# Altium schematic sheet SubSchHVCotrol.SchDoc: High Voltage handling and monitoring
size A3; DocumentNumber: 6; SheetNumber: 6; SheetTotal: 7
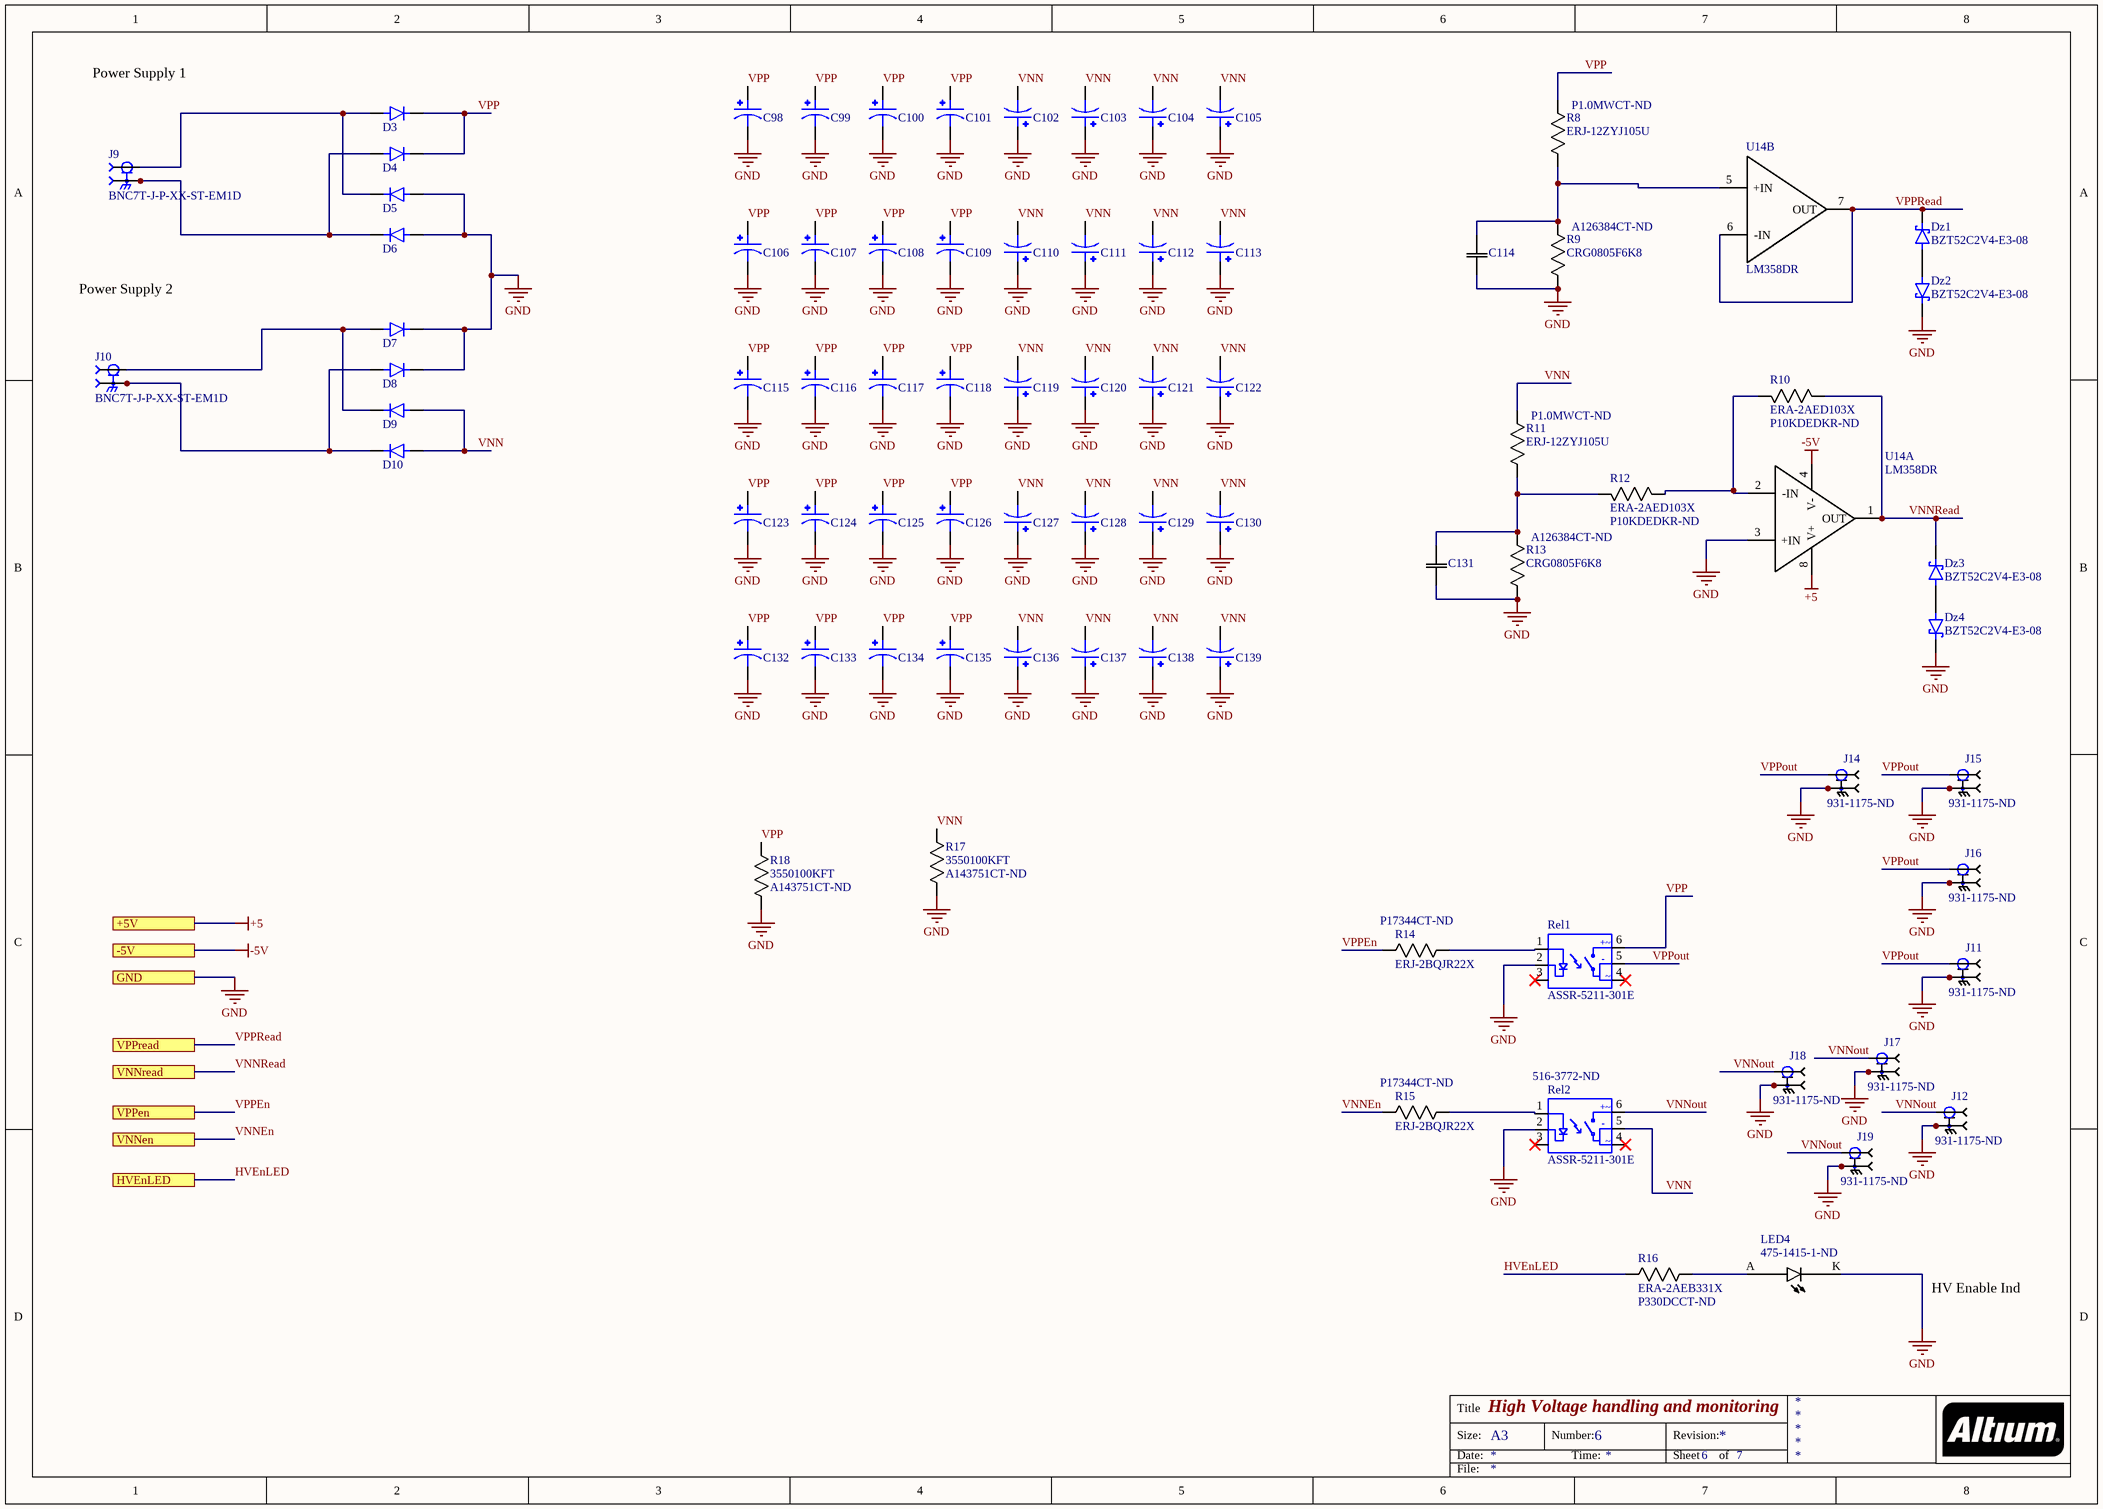
[diagram p0: SubSchHVCotrol.SchDoc]

## Parts
C98  EDH336M400A9TAA  [CAPAE1700X1700N]  (value not drawn)
C99  EDH336M400A9TAA  [CAPAE1700X1700N]  (value not drawn)
C100  EDH336M400A9TAA  [CAPAE1700X1700N]  (value not drawn)
C101  EDH336M400A9TAA  [CAPAE1700X1700N]  (value not drawn)
C102  EDH336M400A9TAA  [CAPAE1700X1700N]  (value not drawn)
C103  EDH336M400A9TAA  [CAPAE1700X1700N]  (value not drawn)
C104  EDH336M400A9TAA  [CAPAE1700X1700N]  (value not drawn)
C105  EDH336M400A9TAA  [CAPAE1700X1700N]  (value not drawn)
C106  EDH336M400A9TAA  [CAPAE1700X1700N]  (value not drawn)
C107  EDH336M400A9TAA  [CAPAE1700X1700N]  (value not drawn)
C108  EDH336M400A9TAA  [CAPAE1700X1700N]  (value not drawn)
C109  EDH336M400A9TAA  [CAPAE1700X1700N]  (value not drawn)
C110  EDH336M400A9TAA  [CAPAE1700X1700N]  (value not drawn)
C111  EDH336M400A9TAA  [CAPAE1700X1700N]  (value not drawn)
C112  EDH336M400A9TAA  [CAPAE1700X1700N]  (value not drawn)
C113  EDH336M400A9TAA  [CAPAE1700X1700N]  (value not drawn)
C114  C0805C104Z5VACTU  [C0805]  (value not drawn)
C115  EDH336M400A9TAA  [CAPAE1700X1700N]  (value not drawn)
C116  EDH336M400A9TAA  [CAPAE1700X1700N]  (value not drawn)
C117  EDH336M400A9TAA  [CAPAE1700X1700N]  (value not drawn)
C118  EDH336M400A9TAA  [CAPAE1700X1700N]  (value not drawn)
C119  EDH336M400A9TAA  [CAPAE1700X1700N]  (value not drawn)
C120  EDH336M400A9TAA  [CAPAE1700X1700N]  (value not drawn)
C121  EDH336M400A9TAA  [CAPAE1700X1700N]  (value not drawn)
C122  EDH336M400A9TAA  [CAPAE1700X1700N]  (value not drawn)
C123  EDH336M400A9TAA  [CAPAE1700X1700N]  (value not drawn)
C124  EDH336M400A9TAA  [CAPAE1700X1700N]  (value not drawn)
C125  EDH336M400A9TAA  [CAPAE1700X1700N]  (value not drawn)
C126  EDH336M400A9TAA  [CAPAE1700X1700N]  (value not drawn)
C127  EDH336M400A9TAA  [CAPAE1700X1700N]  (value not drawn)
C128  EDH336M400A9TAA  [CAPAE1700X1700N]  (value not drawn)
C129  EDH336M400A9TAA  [CAPAE1700X1700N]  (value not drawn)
C130  EDH336M400A9TAA  [CAPAE1700X1700N]  (value not drawn)
C131  C0805C104Z5VACTU  [C0805]  (value not drawn)
C132  EDH336M400A9TAA  [CAPAE1700X1700N]  (value not drawn)
C133  EDH336M400A9TAA  [CAPAE1700X1700N]  (value not drawn)
C134  EDH336M400A9TAA  [CAPAE1700X1700N]  (value not drawn)
C135  EDH336M400A9TAA  [CAPAE1700X1700N]  (value not drawn)
C136  EDH336M400A9TAA  [CAPAE1700X1700N]  (value not drawn)
C137  EDH336M400A9TAA  [CAPAE1700X1700N]  (value not drawn)
C138  EDH336M400A9TAA  [CAPAE1700X1700N]  (value not drawn)
C139  EDH336M400A9TAA  [CAPAE1700X1700N]  (value not drawn)
D3  CD1408-R11000  [CD1408]  (value not drawn)
D4  CD1408-R11000  [CD1408]  (value not drawn)
D5  CD1408-R11000  [CD1408]  (value not drawn)
D6  CD1408-R11000  [CD1408]  (value not drawn)
D7  CD1408-R11000  [CD1408]  (value not drawn)
D8  CD1408-R11000  [CD1408]  (value not drawn)
D9  CD1408-R11000  [CD1408]  (value not drawn)
D10  CD1408-R11000  [CD1408]  (value not drawn)
Dz1  BZT52C2V4-E3-08  [SOD-123]
Dz2  BZT52C2V4-E3-08  [SOD-123]
Dz3  BZT52C2V4-E3-08  [SOD-123]
Dz4  BZT52C2V4-E3-08  [SOD-123]
J9  BNC7T-J-P-XX-ST-EM1D  [SAMTEC_BNC7T-J-P-XX-ST-EM1D]
J10  BNC7T-J-P-XX-ST-EM1D  [SAMTEC_BNC7T-J-P-XX-ST-EM1D]
J11  Supplier Part Number 1: 931-1175-ND  [*TAOGLAS_EMPCB.SMAFSTJ.B.HT_EMPCB.SMAFSTJ.B.HT(Primary)]  (hidden comment: EMPCB.SMAFSTJ.B.HT)
J12  Supplier Part Number 1: 931-1175-ND  [*TAOGLAS_EMPCB.SMAFSTJ.B.HT_EMPCB.SMAFSTJ.B.HT(Primary)]  (hidden comment: EMPCB.SMAFSTJ.B.HT)
J14  Supplier Part Number 1: 931-1175-ND  [*TAOGLAS_EMPCB.SMAFSTJ.B.HT_EMPCB.SMAFSTJ.B.HT(Primary)]  (hidden comment: EMPCB.SMAFSTJ.B.HT)
J15  Supplier Part Number 1: 931-1175-ND  [*TAOGLAS_EMPCB.SMAFSTJ.B.HT_EMPCB.SMAFSTJ.B.HT(Primary)]  (hidden comment: EMPCB.SMAFSTJ.B.HT)
J16  Supplier Part Number 1: 931-1175-ND  [*TAOGLAS_EMPCB.SMAFSTJ.B.HT_EMPCB.SMAFSTJ.B.HT(Primary)]  (hidden comment: EMPCB.SMAFSTJ.B.HT)
J17  Supplier Part Number 1: 931-1175-ND  [*TAOGLAS_EMPCB.SMAFSTJ.B.HT_EMPCB.SMAFSTJ.B.HT(Primary)]  (hidden comment: EMPCB.SMAFSTJ.B.HT)
J18  Supplier Part Number 1: 931-1175-ND  [*TAOGLAS_EMPCB.SMAFSTJ.B.HT_EMPCB.SMAFSTJ.B.HT(Primary)]  (hidden comment: EMPCB.SMAFSTJ.B.HT)
J19  Supplier Part Number 1: 931-1175-ND  [*TAOGLAS_EMPCB.SMAFSTJ.B.HT_EMPCB.SMAFSTJ.B.HT(Primary)]  (hidden comment: EMPCB.SMAFSTJ.B.HT)
LED4  Supplier Part Number 1: 475-1415-1-ND  [LEDr0805]  (hidden comment: LH R974-LP-1)
R8  ERJ-12ZYJ105U  Supplier Part Number 1: P1.0MWCT-ND  [R2010]
R9  CRG0805F6K8  Supplier Part Number 1: A126384CT-ND  [0805]
R10  ERA-2AED103X  Supplier Part Number 1: P10KDEDKR-ND  [R0402]
R11  ERJ-12ZYJ105U  Supplier Part Number 1: P1.0MWCT-ND  [R2010]
R12  ERA-2AED103X  Supplier Part Number 1: P10KDEDKR-ND  [R0402]
R13  CRG0805F6K8  Supplier Part Number 1: A126384CT-ND  [0805]
R14  ERJ-2BQJR22X  Supplier Part Number 1: P17344CT-ND  [0402-A]
R15  ERJ-2BQJR22X  Supplier Part Number 1: P17344CT-ND  [0402-A]
R16  ERA-2AEB331X  Supplier Part Number 1: P330DCCT-ND  [0402]
R17  3550100KFT  Supplier Part Number 1: A143751CT-ND  [355047KJT]
R18  3550100KFT  Supplier Part Number 1: A143751CT-ND  [355047KJT]
Rel1  ASSR-5211-301E  [6-DIPGullWing]
Rel2  ASSR-5211-301E  Supplier Part Number 1: 516-3772-ND  [6-DIPGullWing]
U14  LM358DR  [SOIC127P600X175-8N]  (parts A,B of 2)

## Ports
+5V, -5V, GND, HVEnLED, VNNen, VNNread, VPPen, VPPread

## Nets
+5: U14.8(V+) ; port +5V
-5V: U14.4(V-) ; port -5V
GND: C98.2(NEG) C99.2(NEG) C100.2(NEG) C101.2(NEG) C102.1(POS) C103.1(POS) C104.1(POS) C105.1(POS) C106.2(NEG) C107.2(NEG) C108.2(NEG) C109.2(NEG) C110.1(POS) C111.1(POS) C112.1(POS) C113.1(POS) C114.1 C115.2(NEG) C116.2(NEG) C117.2(NEG) C118.2(NEG) C119.1(POS) C120.1(POS) C121.1(POS) C122.1(POS) C123.2(NEG) C124.2(NEG) C125.2(NEG) C126.2(NEG) C127.1(POS) C128.1(POS) C129.1(POS) C130.1(POS) C131.1 C132.2(NEG) C133.2(NEG) C134.2(NEG) C135.2(NEG) C136.1(POS) C137.1(POS) C138.1(POS) C139.1(POS) D5.2 D6.2 D7.1 D8.1 Dz2.1(K) Dz4.1(K) J11.SH1 J11.SH2 J11.SH3 J11.SH4 J12.SH1 J12.SH2 J12.SH3 J12.SH4 J14.SH1 J14.SH2 J14.SH3 J14.SH4 J15.SH1 J15.SH2 J15.SH3 J15.SH4 J16.SH1 J16.SH2 J16.SH3 J16.SH4 J17.SH1 J17.SH2 J17.SH3 J17.SH4 J18.SH1 J18.SH2 J18.SH3 J18.SH4 J19.SH1 J19.SH2 J19.SH3 J19.SH4 LED4.K(k) R9.1 R13.1 R17.1 R18.1 Rel1.2 Rel2.2 U14.3(+IN) ; port GND
HVEnLED: R16.2 ; port HVEnLED
VNN: C102.2(NEG) C103.2(NEG) C104.2(NEG) C105.2(NEG) C110.2(NEG) C111.2(NEG) C112.2(NEG) C113.2(NEG) C119.2(NEG) C120.2(NEG) C121.2(NEG) C122.2(NEG) C127.2(NEG) C128.2(NEG) C129.2(NEG) C130.2(NEG) C136.2(NEG) C137.2(NEG) C138.2(NEG) C139.2(NEG) D9.2 D10.2 R11.2 R17.2 Rel2.5
VNNEn: R15.2 ; port VNNen
VNNout: J12.1 J17.1 J18.1 J19.1 Rel2.6
VNNRead: Dz3.1(K) R10.2 U14.1(OUT) ; port VNNread
VPP: C98.1(POS) C99.1(POS) C100.1(POS) C101.1(POS) C106.1(POS) C107.1(POS) C108.1(POS) C109.1(POS) C115.1(POS) C116.1(POS) C117.1(POS) C118.1(POS) C123.1(POS) C124.1(POS) C125.1(POS) C126.1(POS) C132.1(POS) C133.1(POS) C134.1(POS) C135.1(POS) D3.1 D4.1 R8.2 R18.2 Rel1.6
VPPEn: R14.2 ; port VPPen
VPPout: J11.1 J14.1 J15.1 J16.1 Rel1.5
VPPRead: Dz1.1(K) U14.6(-IN) U14.7(OUT) ; port VPPread
NetC114_2: C114.2 R8.1 R9.2 U14.5(+IN)
NetC131_2: C131.2 R11.1 R12.1 R13.2
NetD3_2: D3.2 D5.1 J9.1
NetD4_2: D4.2 D6.1 J9.S1 J9.S2 J9.S3 J9.S4
NetD7_2: D7.2 D9.1 J10.1
NetD8_2: D8.2 D10.1 J10.S1 J10.S2 J10.S3 J10.S4
NetDz1_2: Dz1.2(A) Dz2.2(A)
NetDz3_2: Dz3.2(A) Dz4.2(A)
NetLED4_A: LED4.A R16.1
NetR10_1: R10.1 R12.2 U14.2(-IN)
NetR14_1: R14.1 Rel1.1
NetR15_1: R15.1 Rel2.1

Not connected (* = marked no-connect by the designer): Rel1 3* 4*; Rel2 3* 4*

## Notes on the sheet
- Power Supply 1
- Power Supply 2
- HV Enable Ind
- Title
- Size:
- Date:
- A3
- Number:
- Time:
- Revision:
- Sheet
- of
- File:
- (in symbol ASSR-5211-301E) +~; -; ~

## Library data of the parts
C98-C113 C115-C130 C132-C139 = EDH336M400A9TAA: 33ÂµF 400V Aluminum Electrolytic Capacitors Radial, Can - SMD 2000 Hrs @ 105Â°C; MF: KEMET; Package: Radial KEMET; Value: *; Price: None; MP: EDH336M400A9TAA; Availability: Unavailable; SnapEDA_Link: https://www.snapeda.com/parts/EDH336M400A9TAA/KEMET/view-part/2337124/?ref=snap
C114 C131 = Cap_0805: Supplier 1: Digi-Key; Supplier Part Number 1: 399-1177-1-ND
D3-D10 = CD1408-R11000: Diode Standard 1000V 1A Surface Mount 1408; Supplier 1: Digi-Key; Supplier Part Number 1: CD1408-R11000CT-ND
Dz1-Dz4 = BZT52C2V4-E3-08: Zener Diode 2.4V 410mW ±5% Surface Mount SOD-123; Supplier 1: Digi-Key; Supplier Part Number 1: 112-BZT52C2V4-E3-08CT-ND
J9 J10 = BNC7T-J-P-XX-ST-EM1D: BNC Connector Jack, Female Socket 75Ohm Board Edge, End Launch; Panel Mount Solder; MP: BNC7T-J-P-GN-ST-EM1D; MF: Samtec Inc.; Package: None; DigiKey-Purchase-URL: https://snapeda.com/shop?store=DigiKey&id=3266999; Price: None; SnapEDA_Link: https://www.snapeda.com/parts/BNC7T-J-P-GN-ST-EM1D/Samtec%20Inc./view-part/3266999/?ref=snap; Toby_UK-Purchase-URL: https://snapeda.com/shop?store=Toby+UK&id=3266999; Value: *; Availability: Unavailable
J11 J12 J14-J19 = EMPCB.SMAFSTJ.B.HT: SMA Connector Jack, Female Socket 50Ohm Board Edge, End Launch Solder; MF: Taoglas Limited; Package: None; Digi-Key_Part_Number: 931-1175-ND; Digi-Key_Purchase_URL: https://www.digikey.com/product-detail/en/taoglas-limited/EMPCB.SMAFSTJ.B.HT/931-1175-ND/3522337?utm_source=snapeda&utm_medium=aggregator&utm_campaign=symbol; MP: EMPCB.SMAFSTJ.B.HT; SnapEDA_Link: https://www.snapeda.com/parts/EMPCB.SMAFSTJ.B.HT/Taoglas%20Limited/view-part/231078/?ref=snap; Value: *; Supplier 1: Digi-Key
LED4 = LED_0805: LED: / LH R974-LP-1 / LG R971-KN-1 / LY R976-PS-36; Supplier 1: Digi-Key
R8 R11 = Res_2010: Chip Resistor 2010 (5025 Metric) Automotive AEC-Q200 Thick Film; Supplier 1: Digi-Key
R9 R10 R12-R16 = Res_0805: Supplier 1: Digi-Key
R17 R18 = Res_3550: 100K 5W; Supplier 1: Digi-Key
Rel1 Rel2 = ASSR-5211-301E: Solid State SPST-NO (1 Form A) 6-SMD (0.300", 7.62mm) / SSR RELAY SPST-NO 200MA 0-600V
  Rel2: Supplier 1: Digi-Key